# EAGLE schematic AuxilaryWiring (EAGLE 7.6.0)
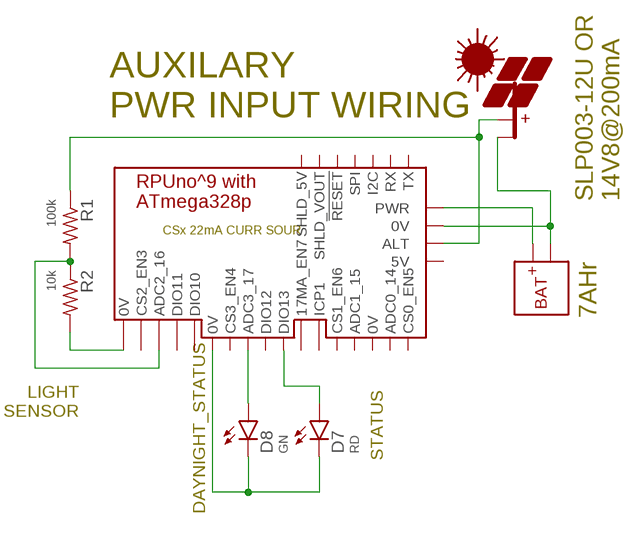
[diagram p0: schematic, sheet 1]

## Parts
BM1  RPUNO  [NA-30]
D7  RD  LED5MM  [LED5MM]
D8  GN  LED5MM  [LED5MM]
PV4  PV  [NA-30]
R1  100k  R0805  [C0805(2012)]
R2  10k  R0805  [C0805(2012)]
U$7  BAT  [NA-30]

## Nets
N$1: BM1.27(0V) R2.2
N$2: BM1.13(ADC2_16) R1.2 R2.1
N$3: BM1.18(DIO13) D7.A
N$4: BM1.28(0V) D7.K D8.K
N$5: BM1.16(ADC3_17) D8.A
N$15: BM1.8(PWR) U$7.1(+BAT)
N$42: BM1.9(0V) PV4.2(-PV) U$7.2(-BAT)
N$50: BM1.20(ALT) PV4.1(+PV) R1.1
Unconnected: BM1.1(TX) BM1.2(RX) BM1.3(I2C) BM1.4(SPI) BM1.5(!RESET) BM1.6(SHLD_5V) BM1.7(SHLD_VOUT) BM1.10(ADC1_15) BM1.11(ADC0_14) BM1.12(ICP1) BM1.14(DIO11) BM1.15(DIO10) BM1.17(DIO12) BM1.19(5V) BM1.21(17MA_EN7) BM1.22(CS1_EN6) BM1.23(CS0_EN5) BM1.24(CS2_EN3) BM1.26(0V) BM1.29(CS3_EN4)

## Notes on the sheet
- AUXILARY 
  PWR INPUT WIRING
- SLP003-12U OR
  14V8@200mA
- 7AHr
- LIGHT
  SENSOR
- STATUS
- DAYNIGHT_STATUS

## Library data of the parts
BM1 = Documentation:RPUNO: BM /w 328p
D7 D8 = D-LED:LED: LED 120120WH [CREE,XHGAWT-00-0000-00000HXE1] LED WHITE 6500K 150LUM-W120120
PV4 = Documentation:PV
R1 R2 = R-C:R: Resiistor American-style symbol
U$7 = Documentation:BAT